# Vivado block design bd_afc3, xck26-sfvc784-2LV-c, Vivado 2021.2
# (continued, part 2 of 2)
current_bd_instance /s03_nodes

# ---- hierarchy /m00_nodes ----
current_bd_instance /m00_nodes
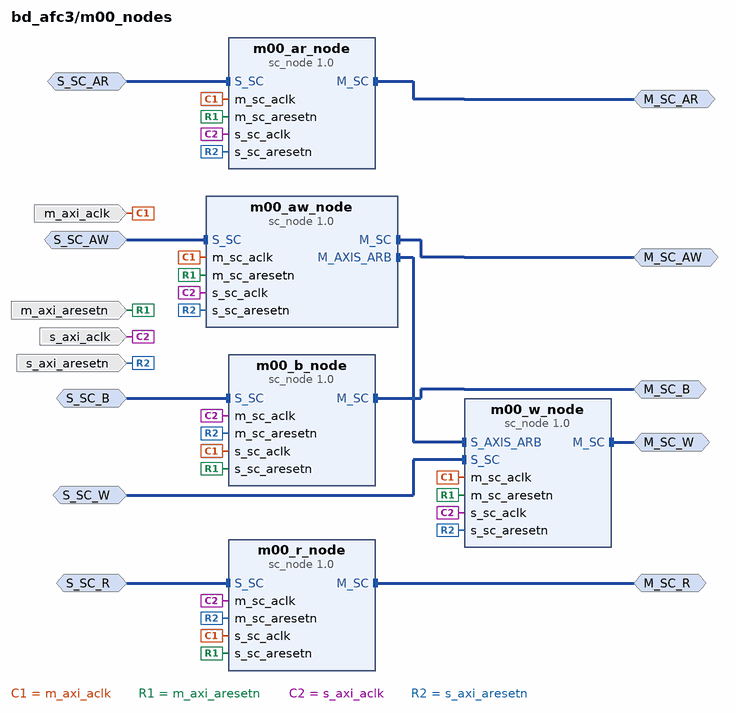
[diagram p11: block diagram inside /m00_nodes]
create_bd_intf_pin -mode Master -vlnv xilinx.com:interface:sc_rtl:1.0 M_SC_AR
create_bd_intf_pin -mode Slave -vlnv xilinx.com:interface:sc_rtl:1.0 S_SC_AR
create_bd_intf_pin -mode Master -vlnv xilinx.com:interface:sc_rtl:1.0 M_SC_R
create_bd_intf_pin -mode Slave -vlnv xilinx.com:interface:sc_rtl:1.0 S_SC_R
create_bd_intf_pin -mode Master -vlnv xilinx.com:interface:sc_rtl:1.0 M_SC_AW
create_bd_intf_pin -mode Slave -vlnv xilinx.com:interface:sc_rtl:1.0 S_SC_AW
create_bd_intf_pin -mode Master -vlnv xilinx.com:interface:sc_rtl:1.0 M_SC_W
create_bd_intf_pin -mode Slave -vlnv xilinx.com:interface:sc_rtl:1.0 S_SC_W
create_bd_intf_pin -mode Master -vlnv xilinx.com:interface:sc_rtl:1.0 M_SC_B
create_bd_intf_pin -mode Slave -vlnv xilinx.com:interface:sc_rtl:1.0 S_SC_B
create_bd_pin -dir I -type clk s_axi_aclk
create_bd_pin -dir I -type rst s_axi_aresetn
create_bd_pin -dir I -type clk m_axi_aclk
create_bd_pin -dir I -type rst m_axi_aresetn

create_bd_cell -type ip -vlnv xilinx.com:ip:sc_node:1.0 m00_ar_node
set_property -dict [list \
  CONFIG.ACLK_RELATIONSHIP 1 \
  CONFIG.ADDR_WIDTH 32 \
  CONFIG.CHANNEL 2 \
  CONFIG.ID_WIDTH 3 \
  CONFIG.M00_NUM_BYTES 16 \
  CONFIG.M01_NUM_BYTES 16 \
  CONFIG.M02_NUM_BYTES 16 \
  CONFIG.M03_NUM_BYTES 16 \
  CONFIG.M04_NUM_BYTES 16 \
  CONFIG.M05_NUM_BYTES 16 \
  CONFIG.M06_NUM_BYTES 16 \
  CONFIG.M07_NUM_BYTES 16 \
  CONFIG.M08_NUM_BYTES 16 \
  CONFIG.M09_NUM_BYTES 16 \
  CONFIG.M10_NUM_BYTES 16 \
  CONFIG.M11_NUM_BYTES 16 \
  CONFIG.M12_NUM_BYTES 16 \
  CONFIG.M13_NUM_BYTES 16 \
  CONFIG.M14_NUM_BYTES 16 \
  CONFIG.M15_NUM_BYTES 16 \
  CONFIG.MAX_PAYLD_BYTES 16 \
  CONFIG.M_SEND_PIPELINE 0 \
  CONFIG.NUM_MI 1 \
  CONFIG.NUM_OUTSTANDING 16 \
  CONFIG.NUM_SI 4 \
  CONFIG.PAYLD_WIDTH 143 \
  CONFIG.S00_NUM_BYTES 16 \
  CONFIG.S01_NUM_BYTES 16 \
  CONFIG.S02_NUM_BYTES 16 \
  CONFIG.S03_NUM_BYTES 16 \
  CONFIG.S04_NUM_BYTES 16 \
  CONFIG.S05_NUM_BYTES 16 \
  CONFIG.S06_NUM_BYTES 16 \
  CONFIG.S07_NUM_BYTES 16 \
  CONFIG.S08_NUM_BYTES 16 \
  CONFIG.S09_NUM_BYTES 16 \
  CONFIG.S10_NUM_BYTES 16 \
  CONFIG.S11_NUM_BYTES 16 \
  CONFIG.S12_NUM_BYTES 16 \
  CONFIG.S13_NUM_BYTES 16 \
  CONFIG.S14_NUM_BYTES 16 \
  CONFIG.S15_NUM_BYTES 16 \
  CONFIG.SC_ROUTE_WIDTH 2 \
  CONFIG.S_LATENCY 1 \
  CONFIG.USER_WIDTH 0 \
] [get_bd_cells m00_ar_node]
create_bd_cell -type ip -vlnv xilinx.com:ip:sc_node:1.0 m00_r_node
set_property -dict [list \
  CONFIG.ACLK_RELATIONSHIP 1 \
  CONFIG.ADDR_WIDTH 32 \
  CONFIG.CHANNEL 0 \
  CONFIG.ID_WIDTH 3 \
  CONFIG.M00_NUM_BYTES 16 \
  CONFIG.M01_NUM_BYTES 16 \
  CONFIG.M02_NUM_BYTES 16 \
  CONFIG.M03_NUM_BYTES 16 \
  CONFIG.M04_NUM_BYTES 16 \
  CONFIG.M05_NUM_BYTES 16 \
  CONFIG.M06_NUM_BYTES 16 \
  CONFIG.M07_NUM_BYTES 16 \
  CONFIG.M08_NUM_BYTES 16 \
  CONFIG.M09_NUM_BYTES 16 \
  CONFIG.M10_NUM_BYTES 16 \
  CONFIG.M11_NUM_BYTES 16 \
  CONFIG.M12_NUM_BYTES 16 \
  CONFIG.M13_NUM_BYTES 16 \
  CONFIG.M14_NUM_BYTES 16 \
  CONFIG.M15_NUM_BYTES 16 \
  CONFIG.MAX_PAYLD_BYTES 16 \
  CONFIG.M_PIPELINE 0 \
  CONFIG.NUM_MI 4 \
  CONFIG.NUM_OUTSTANDING 16 \
  CONFIG.NUM_SI 1 \
  CONFIG.PAYLD_WIDTH 152 \
  CONFIG.S00_NUM_BYTES 16 \
  CONFIG.S01_NUM_BYTES 16 \
  CONFIG.S02_NUM_BYTES 16 \
  CONFIG.S03_NUM_BYTES 16 \
  CONFIG.S04_NUM_BYTES 16 \
  CONFIG.S05_NUM_BYTES 16 \
  CONFIG.S06_NUM_BYTES 16 \
  CONFIG.S07_NUM_BYTES 16 \
  CONFIG.S08_NUM_BYTES 16 \
  CONFIG.S09_NUM_BYTES 16 \
  CONFIG.S10_NUM_BYTES 16 \
  CONFIG.S11_NUM_BYTES 16 \
  CONFIG.S12_NUM_BYTES 16 \
  CONFIG.S13_NUM_BYTES 16 \
  CONFIG.S14_NUM_BYTES 16 \
  CONFIG.S15_NUM_BYTES 16 \
  CONFIG.SC_ROUTE_WIDTH 4 \
  CONFIG.USER_BITS_PER_BYTE 0 \
  CONFIG.USER_WIDTH 0 \
] [get_bd_cells m00_r_node]
create_bd_cell -type ip -vlnv xilinx.com:ip:sc_node:1.0 m00_aw_node
set_property -dict [list \
  CONFIG.ACLK_RELATIONSHIP 1 \
  CONFIG.ADDR_WIDTH 32 \
  CONFIG.CHANNEL 3 \
  CONFIG.ID_WIDTH 3 \
  CONFIG.M00_NUM_BYTES 16 \
  CONFIG.M01_NUM_BYTES 16 \
  CONFIG.M02_NUM_BYTES 16 \
  CONFIG.M03_NUM_BYTES 16 \
  CONFIG.M04_NUM_BYTES 16 \
  CONFIG.M05_NUM_BYTES 16 \
  CONFIG.M06_NUM_BYTES 16 \
  CONFIG.M07_NUM_BYTES 16 \
  CONFIG.M08_NUM_BYTES 16 \
  CONFIG.M09_NUM_BYTES 16 \
  CONFIG.M10_NUM_BYTES 16 \
  CONFIG.M11_NUM_BYTES 16 \
  CONFIG.M12_NUM_BYTES 16 \
  CONFIG.M13_NUM_BYTES 16 \
  CONFIG.M14_NUM_BYTES 16 \
  CONFIG.M15_NUM_BYTES 16 \
  CONFIG.MAX_PAYLD_BYTES 16 \
  CONFIG.M_SEND_PIPELINE 0 \
  CONFIG.NUM_MI 1 \
  CONFIG.NUM_OUTSTANDING 2 \
  CONFIG.NUM_SI 4 \
  CONFIG.PAYLD_WIDTH 143 \
  CONFIG.S00_NUM_BYTES 16 \
  CONFIG.S01_NUM_BYTES 16 \
  CONFIG.S02_NUM_BYTES 16 \
  CONFIG.S03_NUM_BYTES 16 \
  CONFIG.S04_NUM_BYTES 16 \
  CONFIG.S05_NUM_BYTES 16 \
  CONFIG.S06_NUM_BYTES 16 \
  CONFIG.S07_NUM_BYTES 16 \
  CONFIG.S08_NUM_BYTES 16 \
  CONFIG.S09_NUM_BYTES 16 \
  CONFIG.S10_NUM_BYTES 16 \
  CONFIG.S11_NUM_BYTES 16 \
  CONFIG.S12_NUM_BYTES 16 \
  CONFIG.S13_NUM_BYTES 16 \
  CONFIG.S14_NUM_BYTES 16 \
  CONFIG.S15_NUM_BYTES 16 \
  CONFIG.SC_ROUTE_WIDTH 2 \
  CONFIG.S_LATENCY 1 \
  CONFIG.USER_WIDTH 0 \
] [get_bd_cells m00_aw_node]
create_bd_cell -type ip -vlnv xilinx.com:ip:sc_node:1.0 m00_w_node
set_property -dict [list \
  CONFIG.ACLK_RELATIONSHIP 1 \
  CONFIG.ADDR_WIDTH 32 \
  CONFIG.CHANNEL 1 \
  CONFIG.ID_WIDTH 3 \
  CONFIG.M00_NUM_BYTES 16 \
  CONFIG.M01_NUM_BYTES 16 \
  CONFIG.M02_NUM_BYTES 16 \
  CONFIG.M03_NUM_BYTES 16 \
  CONFIG.M04_NUM_BYTES 16 \
  CONFIG.M05_NUM_BYTES 16 \
  CONFIG.M06_NUM_BYTES 16 \
  CONFIG.M07_NUM_BYTES 16 \
  CONFIG.M08_NUM_BYTES 16 \
  CONFIG.M09_NUM_BYTES 16 \
  CONFIG.M10_NUM_BYTES 16 \
  CONFIG.M11_NUM_BYTES 16 \
  CONFIG.M12_NUM_BYTES 16 \
  CONFIG.M13_NUM_BYTES 16 \
  CONFIG.M14_NUM_BYTES 16 \
  CONFIG.M15_NUM_BYTES 16 \
  CONFIG.MAX_PAYLD_BYTES 16 \
  CONFIG.M_SEND_PIPELINE 0 \
  CONFIG.NUM_MI 1 \
  CONFIG.NUM_OUTSTANDING 2 \
  CONFIG.NUM_SI 4 \
  CONFIG.PAYLD_WIDTH 161 \
  CONFIG.S00_NUM_BYTES 16 \
  CONFIG.S01_NUM_BYTES 16 \
  CONFIG.S02_NUM_BYTES 16 \
  CONFIG.S03_NUM_BYTES 16 \
  CONFIG.S04_NUM_BYTES 16 \
  CONFIG.S05_NUM_BYTES 16 \
  CONFIG.S06_NUM_BYTES 16 \
  CONFIG.S07_NUM_BYTES 16 \
  CONFIG.S08_NUM_BYTES 16 \
  CONFIG.S09_NUM_BYTES 16 \
  CONFIG.S10_NUM_BYTES 16 \
  CONFIG.S11_NUM_BYTES 16 \
  CONFIG.S12_NUM_BYTES 16 \
  CONFIG.S13_NUM_BYTES 16 \
  CONFIG.S14_NUM_BYTES 16 \
  CONFIG.S15_NUM_BYTES 16 \
  CONFIG.SC_ROUTE_WIDTH 2 \
  CONFIG.S_LATENCY 1 \
  CONFIG.USER_BITS_PER_BYTE 0 \
  CONFIG.USER_WIDTH 0 \
] [get_bd_cells m00_w_node]
create_bd_cell -type ip -vlnv xilinx.com:ip:sc_node:1.0 m00_b_node
set_property -dict [list \
  CONFIG.ACLK_RELATIONSHIP 1 \
  CONFIG.ADDR_WIDTH 32 \
  CONFIG.CHANNEL 4 \
  CONFIG.ID_WIDTH 3 \
  CONFIG.M00_NUM_BYTES 16 \
  CONFIG.M01_NUM_BYTES 16 \
  CONFIG.M02_NUM_BYTES 16 \
  CONFIG.M03_NUM_BYTES 16 \
  CONFIG.M04_NUM_BYTES 16 \
  CONFIG.M05_NUM_BYTES 16 \
  CONFIG.M06_NUM_BYTES 16 \
  CONFIG.M07_NUM_BYTES 16 \
  CONFIG.M08_NUM_BYTES 16 \
  CONFIG.M09_NUM_BYTES 16 \
  CONFIG.M10_NUM_BYTES 16 \
  CONFIG.M11_NUM_BYTES 16 \
  CONFIG.M12_NUM_BYTES 16 \
  CONFIG.M13_NUM_BYTES 16 \
  CONFIG.M14_NUM_BYTES 16 \
  CONFIG.M15_NUM_BYTES 16 \
  CONFIG.MAX_PAYLD_BYTES 16 \
  CONFIG.M_PIPELINE 0 \
  CONFIG.NUM_MI 4 \
  CONFIG.NUM_OUTSTANDING 2 \
  CONFIG.NUM_SI 1 \
  CONFIG.PAYLD_WIDTH 10 \
  CONFIG.S00_NUM_BYTES 16 \
  CONFIG.S01_NUM_BYTES 16 \
  CONFIG.S02_NUM_BYTES 16 \
  CONFIG.S03_NUM_BYTES 16 \
  CONFIG.S04_NUM_BYTES 16 \
  CONFIG.S05_NUM_BYTES 16 \
  CONFIG.S06_NUM_BYTES 16 \
  CONFIG.S07_NUM_BYTES 16 \
  CONFIG.S08_NUM_BYTES 16 \
  CONFIG.S09_NUM_BYTES 16 \
  CONFIG.S10_NUM_BYTES 16 \
  CONFIG.S11_NUM_BYTES 16 \
  CONFIG.S12_NUM_BYTES 16 \
  CONFIG.S13_NUM_BYTES 16 \
  CONFIG.S14_NUM_BYTES 16 \
  CONFIG.S15_NUM_BYTES 16 \
  CONFIG.SC_ROUTE_WIDTH 4 \
  CONFIG.USER_WIDTH 0 \
] [get_bd_cells m00_b_node]

# ---- hierarchy /m00_exit_pipeline ----
current_bd_instance /m00_exit_pipeline
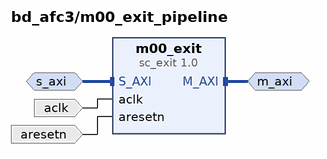
[diagram p12: block diagram inside /m00_exit_pipeline]
create_bd_intf_pin -mode Slave -vlnv xilinx.com:interface:aximm_rtl:1.0 s_axi
create_bd_intf_pin -mode Master -vlnv xilinx.com:interface:aximm_rtl:1.0 m_axi
create_bd_pin -dir I -type clk aclk
create_bd_pin -dir I -type rst aresetn

create_bd_cell -type ip -vlnv xilinx.com:ip:sc_exit:1.0 m00_exit
set_property -dict [list \
  CONFIG.ADDR_WIDTH 49 \
  CONFIG.HAS_BURST 1 \
  CONFIG.HAS_LOCK 0 \
  CONFIG.IS_CASCADED 0 \
  CONFIG.MAX_RUSER_BITS_PER_BYTE 0 \
  CONFIG.MAX_WUSER_BITS_PER_BYTE 0 \
  CONFIG.MEP_IDENTIFIER_WIDTH 3 \
  CONFIG.M_ARUSER_WIDTH 0 \
  CONFIG.M_AWUSER_WIDTH 0 \
  CONFIG.M_BUSER_WIDTH 0 \
  CONFIG.M_ID_WIDTH 0 \
  CONFIG.M_MAX_BURST_LENGTH 4 \
  CONFIG.M_PROTOCOL AXI4 \
  CONFIG.M_RUSER_BITS_PER_BYTE 0 \
  CONFIG.M_RUSER_WIDTH 0 \
  CONFIG.M_WUSER_BITS_PER_BYTE 0 \
  CONFIG.M_WUSER_WIDTH 0 \
  CONFIG.NUM_MSC 2 \
  CONFIG.NUM_READ_OUTSTANDING 16 \
  CONFIG.NUM_WRITE_OUTSTANDING 2 \
  CONFIG.RDATA_WIDTH 128 \
  CONFIG.READ_WRITE_MODE READ_WRITE \
  CONFIG.SSC000_ROUTE 0b0000 \
  CONFIG.SSC001_ROUTE 0b0001 \
  CONFIG.SSC002_ROUTE 0b0010 \
  CONFIG.SSC003_ROUTE 0b0100 \
  CONFIG.SSC004_ROUTE 0b1000 \
  CONFIG.SSC005_ROUTE 0b0000 \
  CONFIG.SSC006_ROUTE 0b0000 \
  CONFIG.SSC007_ROUTE 0b0000 \
  CONFIG.SSC_ROUTE_WIDTH 4 \
  CONFIG.S_ID_WIDTH 3 \
  CONFIG.WDATA_WIDTH 128 \
] [get_bd_cells m00_exit]

# ---- connections ----

current_bd_instance /clk_map
connect_bd_net -net clk_map_aclk_net [get_bd_pins aclk] \
  [get_bd_pins S00_ACLK] [get_bd_pins S01_ACLK] [get_bd_pins S02_ACLK] [get_bd_pins S03_ACLK] [get_bd_pins M00_ACLK] \
  [get_bd_pins M01_ACLK] [get_bd_pins swbd_aclk] [get_bd_pins psr_aclk/slowest_sync_clk]
connect_bd_net -net clk_map_aresetn_net [get_bd_pins aresetn] [get_bd_pins psr_aclk/aux_reset_in]
connect_bd_net [get_bd_pins one/dout] [get_bd_pins psr_aclk/ext_reset_in]
connect_bd_net [get_bd_pins psr_aclk/interconnect_aresetn] \
  [get_bd_pins S00_ARESETN] [get_bd_pins S01_ARESETN] [get_bd_pins S02_ARESETN] [get_bd_pins S03_ARESETN] \
  [get_bd_pins M00_ARESETN] [get_bd_pins M01_ARESETN] [get_bd_pins swbd_aresetn]

current_bd_instance /switchboards
connect_bd_intf_net [get_bd_intf_pins S00_SC_AR] [get_bd_intf_pins ar_switchboard/S00_SC]
connect_bd_intf_net [get_bd_intf_pins S00_SC_AW] [get_bd_intf_pins aw_switchboard/S00_SC]
connect_bd_intf_net [get_bd_intf_pins S00_SC_B] [get_bd_intf_pins b_switchboard/S00_SC]
connect_bd_intf_net [get_bd_intf_pins S00_SC_R] [get_bd_intf_pins r_switchboard/S00_SC]
connect_bd_intf_net [get_bd_intf_pins S00_SC_W] [get_bd_intf_pins w_switchboard/S00_SC]
connect_bd_intf_net [get_bd_intf_pins S01_SC_AR] [get_bd_intf_pins ar_switchboard/S01_SC]
connect_bd_intf_net [get_bd_intf_pins S01_SC_AW] [get_bd_intf_pins aw_switchboard/S01_SC]
connect_bd_intf_net [get_bd_intf_pins S01_SC_B] [get_bd_intf_pins b_switchboard/S01_SC]
connect_bd_intf_net [get_bd_intf_pins S01_SC_R] [get_bd_intf_pins r_switchboard/S01_SC]
connect_bd_intf_net [get_bd_intf_pins S01_SC_W] [get_bd_intf_pins w_switchboard/S01_SC]
connect_bd_intf_net [get_bd_intf_pins S02_SC_AR] [get_bd_intf_pins ar_switchboard/S02_SC]
connect_bd_intf_net [get_bd_intf_pins S02_SC_AW] [get_bd_intf_pins aw_switchboard/S02_SC]
connect_bd_intf_net [get_bd_intf_pins S02_SC_W] [get_bd_intf_pins w_switchboard/S02_SC]
connect_bd_intf_net [get_bd_intf_pins S03_SC_AR] [get_bd_intf_pins ar_switchboard/S03_SC]
connect_bd_intf_net [get_bd_intf_pins S03_SC_AW] [get_bd_intf_pins aw_switchboard/S03_SC]
connect_bd_intf_net [get_bd_intf_pins S03_SC_W] [get_bd_intf_pins w_switchboard/S03_SC]
connect_bd_intf_net [get_bd_intf_pins M00_SC_AR] [get_bd_intf_pins ar_switchboard/M00_SC]
connect_bd_intf_net [get_bd_intf_pins M01_SC_AR] [get_bd_intf_pins ar_switchboard/M01_SC]
connect_bd_intf_net [get_bd_intf_pins M00_SC_AW] [get_bd_intf_pins aw_switchboard/M00_SC]
connect_bd_intf_net [get_bd_intf_pins M01_SC_AW] [get_bd_intf_pins aw_switchboard/M01_SC]
connect_bd_intf_net [get_bd_intf_pins M00_SC_B] [get_bd_intf_pins b_switchboard/M00_SC]
connect_bd_intf_net [get_bd_intf_pins M01_SC_B] [get_bd_intf_pins b_switchboard/M01_SC]
connect_bd_intf_net [get_bd_intf_pins M02_SC_B] [get_bd_intf_pins b_switchboard/M02_SC]
connect_bd_intf_net [get_bd_intf_pins M03_SC_B] [get_bd_intf_pins b_switchboard/M03_SC]
connect_bd_intf_net [get_bd_intf_pins M00_SC_R] [get_bd_intf_pins r_switchboard/M00_SC]
connect_bd_intf_net [get_bd_intf_pins M01_SC_R] [get_bd_intf_pins r_switchboard/M01_SC]
connect_bd_intf_net [get_bd_intf_pins M02_SC_R] [get_bd_intf_pins r_switchboard/M02_SC]
connect_bd_intf_net [get_bd_intf_pins M03_SC_R] [get_bd_intf_pins r_switchboard/M03_SC]
connect_bd_intf_net [get_bd_intf_pins M00_SC_W] [get_bd_intf_pins w_switchboard/M00_SC]
connect_bd_intf_net [get_bd_intf_pins M01_SC_W] [get_bd_intf_pins w_switchboard/M01_SC]
connect_bd_net [get_bd_pins aclk] \
  [get_bd_pins ar_switchboard/aclk] [get_bd_pins aw_switchboard/aclk] [get_bd_pins b_switchboard/aclk] \
  [get_bd_pins r_switchboard/aclk] [get_bd_pins w_switchboard/aclk]

current_bd_instance /s00_entry_pipeline
connect_bd_intf_net [get_bd_intf_pins s00_mmu/M_AXI] [get_bd_intf_pins s00_transaction_regulator/S_AXI]
connect_bd_intf_net [get_bd_intf_pins m_axi] [get_bd_intf_pins s00_si_converter/M_AXI]
connect_bd_intf_net [get_bd_intf_pins s00_transaction_regulator/M_AXI] [get_bd_intf_pins s00_si_converter/S_AXI]
connect_bd_intf_net [get_bd_intf_pins s_axi] [get_bd_intf_pins s00_mmu/S_AXI]
connect_bd_net [get_bd_pins aclk] [get_bd_pins s00_mmu/aclk] [get_bd_pins s00_si_converter/aclk] [get_bd_pins s00_transaction_regulator/aclk]
connect_bd_net [get_bd_pins aresetn] \
  [get_bd_pins s00_mmu/aresetn] [get_bd_pins s00_si_converter/aresetn] [get_bd_pins s00_transaction_regulator/aresetn]

current_bd_instance /s00_nodes
connect_bd_intf_net [get_bd_intf_pins S_SC_AR] [get_bd_intf_pins s00_ar_node/S_SC]
connect_bd_intf_net [get_bd_intf_pins S_SC_R] [get_bd_intf_pins s00_r_node/S_SC]
connect_bd_intf_net [get_bd_intf_pins M_SC_AR] [get_bd_intf_pins s00_ar_node/M_SC]
connect_bd_intf_net [get_bd_intf_pins M_SC_R] [get_bd_intf_pins s00_r_node/M_SC]
connect_bd_net [get_bd_pins m_sc_clk] [get_bd_pins s00_ar_node/m_sc_aclk] [get_bd_pins s00_r_node/s_sc_aclk]
connect_bd_net [get_bd_pins m_sc_resetn] [get_bd_pins s00_ar_node/m_sc_aresetn] [get_bd_pins s00_r_node/s_sc_aresetn]
connect_bd_net [get_bd_pins s_sc_clk] [get_bd_pins s00_ar_node/s_sc_aclk] [get_bd_pins s00_r_node/m_sc_aclk]
connect_bd_net [get_bd_pins s_sc_resetn] [get_bd_pins s00_ar_node/s_sc_aresetn] [get_bd_pins s00_r_node/m_sc_aresetn]

current_bd_instance /s01_entry_pipeline
connect_bd_intf_net [get_bd_intf_pins s01_mmu/M_AXI] [get_bd_intf_pins s01_transaction_regulator/S_AXI]
connect_bd_intf_net [get_bd_intf_pins m_axi] [get_bd_intf_pins s01_si_converter/M_AXI]
connect_bd_intf_net [get_bd_intf_pins s01_transaction_regulator/M_AXI] [get_bd_intf_pins s01_si_converter/S_AXI]
connect_bd_intf_net [get_bd_intf_pins s_axi] [get_bd_intf_pins s01_mmu/S_AXI]
connect_bd_net [get_bd_pins aclk] [get_bd_pins s01_mmu/aclk] [get_bd_pins s01_si_converter/aclk] [get_bd_pins s01_transaction_regulator/aclk]
connect_bd_net [get_bd_pins aresetn] \
  [get_bd_pins s01_mmu/aresetn] [get_bd_pins s01_si_converter/aresetn] [get_bd_pins s01_transaction_regulator/aresetn]

current_bd_instance /s01_nodes
connect_bd_intf_net [get_bd_intf_pins S_SC_AR] [get_bd_intf_pins s01_ar_node/S_SC]
connect_bd_intf_net [get_bd_intf_pins S_SC_AW] [get_bd_intf_pins s01_aw_node/S_SC]
connect_bd_intf_net [get_bd_intf_pins S_SC_B] [get_bd_intf_pins s01_b_node/S_SC]
connect_bd_intf_net [get_bd_intf_pins S_SC_R] [get_bd_intf_pins s01_r_node/S_SC]
connect_bd_intf_net [get_bd_intf_pins S_SC_W] [get_bd_intf_pins s01_w_node/S_SC]
connect_bd_intf_net [get_bd_intf_pins M_SC_AR] [get_bd_intf_pins s01_ar_node/M_SC]
connect_bd_intf_net [get_bd_intf_pins M_SC_AW] [get_bd_intf_pins s01_aw_node/M_SC]
connect_bd_intf_net [get_bd_intf_pins M_SC_B] [get_bd_intf_pins s01_b_node/M_SC]
connect_bd_intf_net [get_bd_intf_pins M_SC_R] [get_bd_intf_pins s01_r_node/M_SC]
connect_bd_intf_net [get_bd_intf_pins M_SC_W] [get_bd_intf_pins s01_w_node/M_SC]
connect_bd_net [get_bd_pins m_sc_clk] \
  [get_bd_pins s01_ar_node/m_sc_aclk] [get_bd_pins s01_aw_node/m_sc_aclk] [get_bd_pins s01_w_node/m_sc_aclk] \
  [get_bd_pins s01_r_node/s_sc_aclk] [get_bd_pins s01_b_node/s_sc_aclk]
connect_bd_net [get_bd_pins m_sc_resetn] \
  [get_bd_pins s01_ar_node/m_sc_aresetn] [get_bd_pins s01_aw_node/m_sc_aresetn] [get_bd_pins s01_w_node/m_sc_aresetn] \
  [get_bd_pins s01_r_node/s_sc_aresetn] [get_bd_pins s01_b_node/s_sc_aresetn]
connect_bd_net [get_bd_pins s_sc_clk] \
  [get_bd_pins s01_ar_node/s_sc_aclk] [get_bd_pins s01_aw_node/s_sc_aclk] [get_bd_pins s01_w_node/s_sc_aclk] \
  [get_bd_pins s01_r_node/m_sc_aclk] [get_bd_pins s01_b_node/m_sc_aclk]
connect_bd_net [get_bd_pins s_sc_resetn] \
  [get_bd_pins s01_ar_node/s_sc_aresetn] [get_bd_pins s01_aw_node/s_sc_aresetn] [get_bd_pins s01_w_node/s_sc_aresetn] \
  [get_bd_pins s01_r_node/m_sc_aresetn] [get_bd_pins s01_b_node/m_sc_aresetn]

current_bd_instance /s02_entry_pipeline
connect_bd_intf_net [get_bd_intf_pins s02_mmu/M_AXI] [get_bd_intf_pins s02_transaction_regulator/S_AXI]
connect_bd_intf_net [get_bd_intf_pins m_axi] [get_bd_intf_pins s02_si_converter/M_AXI]
connect_bd_intf_net [get_bd_intf_pins s02_transaction_regulator/M_AXI] [get_bd_intf_pins s02_si_converter/S_AXI]
connect_bd_intf_net [get_bd_intf_pins s_axi] [get_bd_intf_pins s02_mmu/S_AXI]
connect_bd_net [get_bd_pins aclk] [get_bd_pins s02_mmu/aclk] [get_bd_pins s02_si_converter/aclk] [get_bd_pins s02_transaction_regulator/aclk]
connect_bd_net [get_bd_pins aresetn] \
  [get_bd_pins s02_mmu/aresetn] [get_bd_pins s02_si_converter/aresetn] [get_bd_pins s02_transaction_regulator/aresetn]

current_bd_instance /s02_nodes
connect_bd_intf_net [get_bd_intf_pins S_SC_AR] [get_bd_intf_pins s02_ar_node/S_SC]
connect_bd_intf_net [get_bd_intf_pins S_SC_R] [get_bd_intf_pins s02_r_node/S_SC]
connect_bd_intf_net [get_bd_intf_pins M_SC_AR] [get_bd_intf_pins s02_ar_node/M_SC]
connect_bd_intf_net [get_bd_intf_pins M_SC_R] [get_bd_intf_pins s02_r_node/M_SC]
connect_bd_net [get_bd_pins m_sc_clk] [get_bd_pins s02_ar_node/m_sc_aclk] [get_bd_pins s02_r_node/s_sc_aclk]
connect_bd_net [get_bd_pins m_sc_resetn] [get_bd_pins s02_ar_node/m_sc_aresetn] [get_bd_pins s02_r_node/s_sc_aresetn]
connect_bd_net [get_bd_pins s_sc_clk] [get_bd_pins s02_ar_node/s_sc_aclk] [get_bd_pins s02_r_node/m_sc_aclk]
connect_bd_net [get_bd_pins s_sc_resetn] [get_bd_pins s02_ar_node/s_sc_aresetn] [get_bd_pins s02_r_node/m_sc_aresetn]

current_bd_instance /s03_entry_pipeline
connect_bd_intf_net [get_bd_intf_pins s03_mmu/M_AXI] [get_bd_intf_pins s03_transaction_regulator/S_AXI]
connect_bd_intf_net [get_bd_intf_pins m_axi] [get_bd_intf_pins s03_si_converter/M_AXI]
connect_bd_intf_net [get_bd_intf_pins s03_transaction_regulator/M_AXI] [get_bd_intf_pins s03_si_converter/S_AXI]
connect_bd_intf_net [get_bd_intf_pins s_axi] [get_bd_intf_pins s03_mmu/S_AXI]
connect_bd_net [get_bd_pins aclk] [get_bd_pins s03_mmu/aclk] [get_bd_pins s03_si_converter/aclk] [get_bd_pins s03_transaction_regulator/aclk]
connect_bd_net [get_bd_pins aresetn] \
  [get_bd_pins s03_mmu/aresetn] [get_bd_pins s03_si_converter/aresetn] [get_bd_pins s03_transaction_regulator/aresetn]

current_bd_instance /s03_nodes
connect_bd_intf_net [get_bd_intf_pins S_SC_AR] [get_bd_intf_pins s03_ar_node/S_SC]
connect_bd_intf_net [get_bd_intf_pins S_SC_AW] [get_bd_intf_pins s03_aw_node/S_SC]
connect_bd_intf_net [get_bd_intf_pins S_SC_B] [get_bd_intf_pins s03_b_node/S_SC]
connect_bd_intf_net [get_bd_intf_pins S_SC_R] [get_bd_intf_pins s03_r_node/S_SC]
connect_bd_intf_net [get_bd_intf_pins S_SC_W] [get_bd_intf_pins s03_w_node/S_SC]
connect_bd_intf_net [get_bd_intf_pins M_SC_AR] [get_bd_intf_pins s03_ar_node/M_SC]
connect_bd_intf_net [get_bd_intf_pins M_SC_AW] [get_bd_intf_pins s03_aw_node/M_SC]
connect_bd_intf_net [get_bd_intf_pins M_SC_B] [get_bd_intf_pins s03_b_node/M_SC]
connect_bd_intf_net [get_bd_intf_pins M_SC_R] [get_bd_intf_pins s03_r_node/M_SC]
connect_bd_intf_net [get_bd_intf_pins M_SC_W] [get_bd_intf_pins s03_w_node/M_SC]
connect_bd_net [get_bd_pins m_sc_clk] \
  [get_bd_pins s03_ar_node/m_sc_aclk] [get_bd_pins s03_aw_node/m_sc_aclk] [get_bd_pins s03_w_node/m_sc_aclk] \
  [get_bd_pins s03_r_node/s_sc_aclk] [get_bd_pins s03_b_node/s_sc_aclk]
connect_bd_net [get_bd_pins m_sc_resetn] \
  [get_bd_pins s03_ar_node/m_sc_aresetn] [get_bd_pins s03_aw_node/m_sc_aresetn] [get_bd_pins s03_w_node/m_sc_aresetn] \
  [get_bd_pins s03_r_node/s_sc_aresetn] [get_bd_pins s03_b_node/s_sc_aresetn]
connect_bd_net [get_bd_pins s_sc_clk] \
  [get_bd_pins s03_ar_node/s_sc_aclk] [get_bd_pins s03_aw_node/s_sc_aclk] [get_bd_pins s03_w_node/s_sc_aclk] \
  [get_bd_pins s03_r_node/m_sc_aclk] [get_bd_pins s03_b_node/m_sc_aclk]
connect_bd_net [get_bd_pins s_sc_resetn] \
  [get_bd_pins s03_ar_node/s_sc_aresetn] [get_bd_pins s03_aw_node/s_sc_aresetn] [get_bd_pins s03_w_node/s_sc_aresetn] \
  [get_bd_pins s03_r_node/m_sc_aresetn] [get_bd_pins s03_b_node/m_sc_aresetn]

current_bd_instance /m00_nodes
connect_bd_intf_net [get_bd_intf_pins S_SC_AR] [get_bd_intf_pins m00_ar_node/S_SC]
connect_bd_intf_net [get_bd_intf_pins S_SC_AW] [get_bd_intf_pins m00_aw_node/S_SC]
connect_bd_intf_net [get_bd_intf_pins S_SC_B] [get_bd_intf_pins m00_b_node/S_SC]
connect_bd_intf_net [get_bd_intf_pins S_SC_R] [get_bd_intf_pins m00_r_node/S_SC]
connect_bd_intf_net [get_bd_intf_pins S_SC_W] [get_bd_intf_pins m00_w_node/S_SC]
connect_bd_intf_net [get_bd_intf_pins M_SC_AR] [get_bd_intf_pins m00_ar_node/M_SC]
connect_bd_intf_net [get_bd_intf_pins m00_aw_node/M_AXIS_ARB] [get_bd_intf_pins m00_w_node/S_AXIS_ARB]
connect_bd_intf_net [get_bd_intf_pins M_SC_AW] [get_bd_intf_pins m00_aw_node/M_SC]
connect_bd_intf_net [get_bd_intf_pins M_SC_B] [get_bd_intf_pins m00_b_node/M_SC]
connect_bd_intf_net [get_bd_intf_pins M_SC_R] [get_bd_intf_pins m00_r_node/M_SC]
connect_bd_intf_net [get_bd_intf_pins M_SC_W] [get_bd_intf_pins m00_w_node/M_SC]
connect_bd_net [get_bd_pins m_axi_aclk] \
  [get_bd_pins m00_ar_node/m_sc_aclk] [get_bd_pins m00_aw_node/m_sc_aclk] [get_bd_pins m00_w_node/m_sc_aclk] \
  [get_bd_pins m00_r_node/s_sc_aclk] [get_bd_pins m00_b_node/s_sc_aclk]
connect_bd_net [get_bd_pins m_axi_aresetn] \
  [get_bd_pins m00_ar_node/m_sc_aresetn] [get_bd_pins m00_aw_node/m_sc_aresetn] [get_bd_pins m00_w_node/m_sc_aresetn] \
  [get_bd_pins m00_r_node/s_sc_aresetn] [get_bd_pins m00_b_node/s_sc_aresetn]
connect_bd_net [get_bd_pins s_axi_aclk] \
  [get_bd_pins m00_ar_node/s_sc_aclk] [get_bd_pins m00_aw_node/s_sc_aclk] [get_bd_pins m00_w_node/s_sc_aclk] \
  [get_bd_pins m00_r_node/m_sc_aclk] [get_bd_pins m00_b_node/m_sc_aclk]
connect_bd_net [get_bd_pins s_axi_aresetn] \
  [get_bd_pins m00_ar_node/s_sc_aresetn] [get_bd_pins m00_aw_node/s_sc_aresetn] [get_bd_pins m00_w_node/s_sc_aresetn] \
  [get_bd_pins m00_r_node/m_sc_aresetn] [get_bd_pins m00_b_node/m_sc_aresetn]

current_bd_instance /m00_exit_pipeline
connect_bd_intf_net [get_bd_intf_pins m_axi] [get_bd_intf_pins m00_exit/M_AXI]
connect_bd_intf_net [get_bd_intf_pins s_axi] [get_bd_intf_pins m00_exit/S_AXI]
connect_bd_net [get_bd_pins aclk] [get_bd_pins m00_exit/aclk]
connect_bd_net [get_bd_pins aresetn] [get_bd_pins m00_exit/aresetn]

current_bd_instance /
connect_bd_intf_net [get_bd_intf_ports S00_AXI] [get_bd_intf_pins s00_entry_pipeline/s_axi]
connect_bd_intf_net [get_bd_intf_ports S01_AXI] [get_bd_intf_pins s01_entry_pipeline/s_axi]
connect_bd_intf_net [get_bd_intf_ports S02_AXI] [get_bd_intf_pins s02_entry_pipeline/s_axi]
connect_bd_intf_net [get_bd_intf_ports S03_AXI] [get_bd_intf_pins s03_entry_pipeline/s_axi]
connect_bd_intf_net [get_bd_intf_pins s00_nodes/S_SC_AR] [get_bd_intf_pins s00_axi2sc/M_SC_AR]
connect_bd_intf_net [get_bd_intf_pins s01_nodes/S_SC_AR] [get_bd_intf_pins s01_axi2sc/M_SC_AR]
connect_bd_intf_net [get_bd_intf_pins s02_nodes/S_SC_AR] [get_bd_intf_pins s02_axi2sc/M_SC_AR]
connect_bd_intf_net [get_bd_intf_pins s03_nodes/S_SC_AR] [get_bd_intf_pins s03_axi2sc/M_SC_AR]
connect_bd_intf_net [get_bd_intf_pins m00_nodes/S_SC_AR] [get_bd_intf_pins switchboards/M00_SC_AR]
connect_bd_intf_net [get_bd_intf_pins s01_nodes/S_SC_AW] [get_bd_intf_pins s01_axi2sc/M_SC_AW]
connect_bd_intf_net [get_bd_intf_pins s03_nodes/S_SC_AW] [get_bd_intf_pins s03_axi2sc/M_SC_AW]
connect_bd_intf_net [get_bd_intf_pins m00_nodes/S_SC_AW] [get_bd_intf_pins switchboards/M00_SC_AW]
connect_bd_intf_net [get_bd_intf_pins s01_nodes/S_SC_B] [get_bd_intf_pins switchboards/M01_SC_B]
connect_bd_intf_net [get_bd_intf_pins s03_nodes/S_SC_B] [get_bd_intf_pins switchboards/M03_SC_B]
connect_bd_intf_net [get_bd_intf_pins m00_nodes/S_SC_B] [get_bd_intf_pins m00_sc2axi/M_SC_B]
connect_bd_intf_net [get_bd_intf_pins s00_nodes/S_SC_R] [get_bd_intf_pins switchboards/M00_SC_R]
connect_bd_intf_net [get_bd_intf_pins s01_nodes/S_SC_R] [get_bd_intf_pins switchboards/M01_SC_R]
connect_bd_intf_net [get_bd_intf_pins s02_nodes/S_SC_R] [get_bd_intf_pins switchboards/M02_SC_R]
connect_bd_intf_net [get_bd_intf_pins s03_nodes/S_SC_R] [get_bd_intf_pins switchboards/M03_SC_R]
connect_bd_intf_net [get_bd_intf_pins m00_nodes/S_SC_R] [get_bd_intf_pins m00_sc2axi/M_SC_R]
connect_bd_intf_net [get_bd_intf_pins s01_nodes/S_SC_W] [get_bd_intf_pins s01_axi2sc/M_SC_W]
connect_bd_intf_net [get_bd_intf_pins s03_nodes/S_SC_W] [get_bd_intf_pins s03_axi2sc/M_SC_W]
connect_bd_intf_net [get_bd_intf_pins m00_nodes/S_SC_W] [get_bd_intf_pins switchboards/M00_SC_W]
connect_bd_intf_net [get_bd_intf_ports M00_AXI] [get_bd_intf_pins m00_exit_pipeline/m_axi]
connect_bd_intf_net [get_bd_intf_pins m00_nodes/M_SC_AR] [get_bd_intf_pins m00_sc2axi/S_SC_AR]
connect_bd_intf_net [get_bd_intf_pins m00_nodes/M_SC_AW] [get_bd_intf_pins m00_sc2axi/S_SC_AW]
connect_bd_intf_net [get_bd_intf_pins m00_nodes/M_SC_B] [get_bd_intf_pins switchboards/S00_SC_B]
connect_bd_intf_net [get_bd_intf_pins m00_nodes/M_SC_R] [get_bd_intf_pins switchboards/S00_SC_R]
connect_bd_intf_net [get_bd_intf_pins m00_nodes/M_SC_W] [get_bd_intf_pins m00_sc2axi/S_SC_W]
connect_bd_intf_net [get_bd_intf_pins m00_sc2axi/M_AXI] [get_bd_intf_pins m00_exit_pipeline/s_axi]
connect_bd_intf_net [get_bd_intf_pins s00_entry_pipeline/m_axi] [get_bd_intf_pins s00_axi2sc/S_AXI]
connect_bd_intf_net [get_bd_intf_pins s00_nodes/M_SC_AR] [get_bd_intf_pins switchboards/S00_SC_AR]
connect_bd_intf_net [get_bd_intf_pins s00_nodes/M_SC_R] [get_bd_intf_pins s00_axi2sc/S_SC_R]
connect_bd_intf_net [get_bd_intf_pins s01_entry_pipeline/m_axi] [get_bd_intf_pins s01_axi2sc/S_AXI]
connect_bd_intf_net [get_bd_intf_pins s01_nodes/M_SC_AR] [get_bd_intf_pins switchboards/S01_SC_AR]
connect_bd_intf_net [get_bd_intf_pins s01_nodes/M_SC_AW] [get_bd_intf_pins switchboards/S01_SC_AW]
connect_bd_intf_net [get_bd_intf_pins s01_nodes/M_SC_B] [get_bd_intf_pins s01_axi2sc/S_SC_B]
connect_bd_intf_net [get_bd_intf_pins s01_nodes/M_SC_R] [get_bd_intf_pins s01_axi2sc/S_SC_R]
connect_bd_intf_net [get_bd_intf_pins s01_nodes/M_SC_W] [get_bd_intf_pins switchboards/S01_SC_W]
connect_bd_intf_net [get_bd_intf_pins s02_entry_pipeline/m_axi] [get_bd_intf_pins s02_axi2sc/S_AXI]
connect_bd_intf_net [get_bd_intf_pins s02_nodes/M_SC_AR] [get_bd_intf_pins switchboards/S02_SC_AR]
connect_bd_intf_net [get_bd_intf_pins s02_nodes/M_SC_R] [get_bd_intf_pins s02_axi2sc/S_SC_R]
connect_bd_intf_net [get_bd_intf_pins s03_entry_pipeline/m_axi] [get_bd_intf_pins s03_axi2sc/S_AXI]
connect_bd_intf_net [get_bd_intf_pins s03_nodes/M_SC_AR] [get_bd_intf_pins switchboards/S03_SC_AR]
connect_bd_intf_net [get_bd_intf_pins s03_nodes/M_SC_AW] [get_bd_intf_pins switchboards/S03_SC_AW]
connect_bd_intf_net [get_bd_intf_pins s03_nodes/M_SC_B] [get_bd_intf_pins s03_axi2sc/S_SC_B]
connect_bd_intf_net [get_bd_intf_pins s03_nodes/M_SC_R] [get_bd_intf_pins s03_axi2sc/S_SC_R]
connect_bd_intf_net [get_bd_intf_pins s03_nodes/M_SC_W] [get_bd_intf_pins switchboards/S03_SC_W]
connect_bd_net -net aclk_1 [get_bd_pins clk_map/S00_ACLK] \
  [get_bd_pins s00_entry_pipeline/aclk] [get_bd_pins s00_axi2sc/aclk] [get_bd_pins s00_nodes/s_sc_clk]
connect_bd_net -net aclk_2 [get_bd_pins clk_map/S01_ACLK] \
  [get_bd_pins s01_entry_pipeline/aclk] [get_bd_pins s01_axi2sc/aclk] [get_bd_pins s01_nodes/s_sc_clk]
connect_bd_net -net aclk_3 [get_bd_pins clk_map/S02_ACLK] \
  [get_bd_pins s02_entry_pipeline/aclk] [get_bd_pins s02_axi2sc/aclk] [get_bd_pins s02_nodes/s_sc_clk]
connect_bd_net -net aclk_4 [get_bd_pins clk_map/S03_ACLK] \
  [get_bd_pins s03_entry_pipeline/aclk] [get_bd_pins s03_axi2sc/aclk] [get_bd_pins s03_nodes/s_sc_clk]
connect_bd_net -net aclk_net [get_bd_ports aclk] [get_bd_pins clk_map/aclk]
connect_bd_net [get_bd_ports aresetn] [get_bd_pins clk_map/aresetn]
connect_bd_net -net aresetn_2 [get_bd_pins clk_map/S00_ARESETN] [get_bd_pins s00_entry_pipeline/aresetn] [get_bd_pins s00_nodes/s_sc_resetn]
connect_bd_net -net aresetn_3 [get_bd_pins clk_map/S01_ARESETN] [get_bd_pins s01_entry_pipeline/aresetn] [get_bd_pins s01_nodes/s_sc_resetn]
connect_bd_net -net aresetn_4 [get_bd_pins clk_map/S02_ARESETN] [get_bd_pins s02_entry_pipeline/aresetn] [get_bd_pins s02_nodes/s_sc_resetn]
connect_bd_net -net aresetn_5 [get_bd_pins clk_map/S03_ARESETN] [get_bd_pins s03_entry_pipeline/aresetn] [get_bd_pins s03_nodes/s_sc_resetn]
# net aresetn_net has one end: clk_map/aresetn_out
connect_bd_net [get_bd_pins clk_map/M00_ACLK] [get_bd_pins m00_sc2axi/aclk] [get_bd_pins m00_nodes/m_axi_aclk] [get_bd_pins m00_exit_pipeline/aclk]
connect_bd_net -net m_axi_aresetn_1 [get_bd_pins clk_map/M00_ARESETN] [get_bd_pins m00_nodes/m_axi_aresetn] [get_bd_pins m00_exit_pipeline/aresetn]
connect_bd_net -net swbd_aclk_net [get_bd_pins clk_map/swbd_aclk] \
  [get_bd_pins switchboards/aclk] [get_bd_pins s00_nodes/m_sc_clk] [get_bd_pins s01_nodes/m_sc_clk] \
  [get_bd_pins s02_nodes/m_sc_clk] [get_bd_pins s03_nodes/m_sc_clk] [get_bd_pins m00_nodes/s_axi_aclk]
connect_bd_net -net swbd_aresetn_net [get_bd_pins clk_map/swbd_aresetn] \
  [get_bd_pins switchboards/aresetn] [get_bd_pins s00_nodes/m_sc_resetn] [get_bd_pins s01_nodes/m_sc_resetn] \
  [get_bd_pins s02_nodes/m_sc_resetn] [get_bd_pins s03_nodes/m_sc_resetn] [get_bd_pins m00_nodes/s_axi_aresetn]

validate_bd_design
save_bd_design
